# Altium project rbe3001-plan-c.PrjPcb
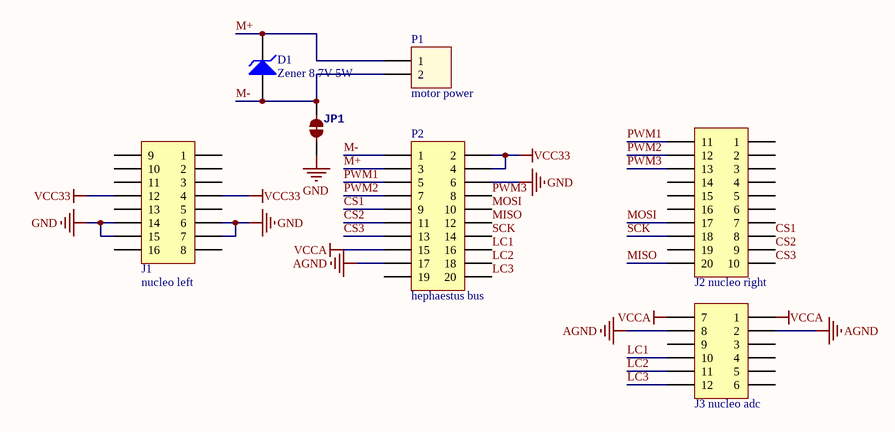
[diagram p0: Sheet1.SchDoc]
1 sheet, 7 parts. Net scope: global (net labels, ports and power ports of the same name join across sheets).
Board file: PCB1.PcbDoc

## Sheet Sheet1.SchDoc
size A

### Parts
D1  Zener 8.7V 5W  [DIODE-0.7]
J1  nucleo left  [61301621121]
J2  nucleo right  [61302021121]
J3  nucleo adc  [61301221121]
JP1  JUMPER-PAD-2-NC_BY_TRACENO_SILK  [PAD-JUMPER-2-NC_BY_TRACE_NO_SILK]  (value not drawn)  (net tie, no BOM)
P1  motor power  [691213710002]
P2  hephaestus bus  [612020235121]

### Nets
AGND: J3.2 J3.8 P2.17
GND: J1.6 J1.7 J1.14 J1.15 JP1.1 P2.6
VCC33: J1.4 J1.12 P2.2 P2.4
VCCA: J3.1 J3.7 P2.15
CS1: J2.8 P2.9
CS2: J2.9 P2.11
CS3: J2.10 P2.13
LC1: J3.10 P2.16
LC2: J3.11 P2.18
LC3: J3.12 P2.20
M+: D1.2(K) P1.1 P2.3
M-: D1.1(A) JP1.2 P1.2 P2.1
MISO: J2.20 P2.12
MOSI: J2.17 P2.10
PWM1: J2.11 P2.5
PWM2: J2.12 P2.7
PWM3: J2.13 P2.8
SCK: J2.18 P2.14

Not connected (* = marked no-connect by the designer): J1 1 2 3 5 8 9 10 11 13 16; J2 1 2 3 4 5 6 7 14 15 16 19; J3 3 4 5 6 9; P2 19

### Library data of the parts
D1 = D Zener: 1N5345BRLG; Published: 8-Jun-2000; LatestRevisionDate: 17-Jul-2002; LatestRevisionNote: Re-released for DXP Platform.; PackageReference: DIODE-0.7; Publisher: Altium Limited; PackageDescription: Diode, Thru-Hole; 2 Leads; 0.7 in Pin Spacing
J1 = 61301621121: WR-PHD 2.54 mm THT Dual Pin Header, 16p; PublishedDate: July 2016; Publisher: Wurth Elektronik; ComponentLink1Description: Manufacturer; ComponentLink1URL: http://www.we-online.de; ComponentLink2Description: Datasheet; ComponentLink2URL: http://katalog.we-online.de/em/datasheet/6130xx21121.pdf; PartNumber: 61301621121; PinNumber: 16p
J2 = 61302021121: WR-PHD 2.54 mm THT Dual Pin Header, 20p; PublishedDate: July 2016; Publisher: Wurth Elektronik; ComponentLink1Description: Manufacturer; ComponentLink1URL: http://www.we-online.de; ComponentLink2Description: Datasheet; ComponentLink2URL: http://katalog.we-online.de/em/datasheet/6130xx21121.pdf; PartNumber: 61302021121; PinNumber: 20p
J3 = 61301221121: WR-PHD 2.54 mm THT Dual Pin Header, 12p; PublishedDate: July 2016; Publisher: Wurth Elektronik; ComponentLink1Description: Manufacturer; ComponentLink1URL: http://www.we-online.de; ComponentLink2Description: Datasheet; ComponentLink2URL: http://katalog.we-online.de/em/datasheet/6130xx21121.pdf; PartNumber: 61301221121; PinNumber: 12p
P1 = 691213710002: WR-TBL Serie 213 - 5.00 mm Horizontal Entry Modular, 2p; Pitch: 5 mm; Pin Number: 2; ComponentLink1Description: Manufacturer; ComponentLink1URL: http://www.we-online.de; ComponentLink2Description: Datasheet; ComponentLink2URL: http://katalog.we-online.de/em/datasheet/6912137100xx.pdf; Part Number: 691213710002; Published Date: March 2017; Publisher: Wurth Elektronik
P2 = 612020235121: WR-BHD 2.54mm Male Box Header High Temperature; Manufacturer: Wurth Elektronik; ComponentLink1 Description: Manufacturer; ComponentLink2 Description: Datasheet; NoPins: 20; Created Date: March 2016; partNo: 612020235121; ComponentLink1URL: http://www.we-online.com; ComponentLink2URL: http://katalog.we-online.de/em/datasheet/6120xx235121.pdf; Created by: Baojun Chen